# Altium schematic sheet 1_P1.schdoc
size 604 x 431 mm; Symbol: Sheet-Symbol_A2; Device: Sheet-Symbol_A2; @Page Name: P1; @Create Date: 2023-08-03; @Page Count: 1; @Page No: 1; @Project Name: FOC1.0; @Schematic Name: Schematic1; @Update Date: 2023-08-06; Company: 嘉立创EDA; Page Size: A2; Version: V1.0
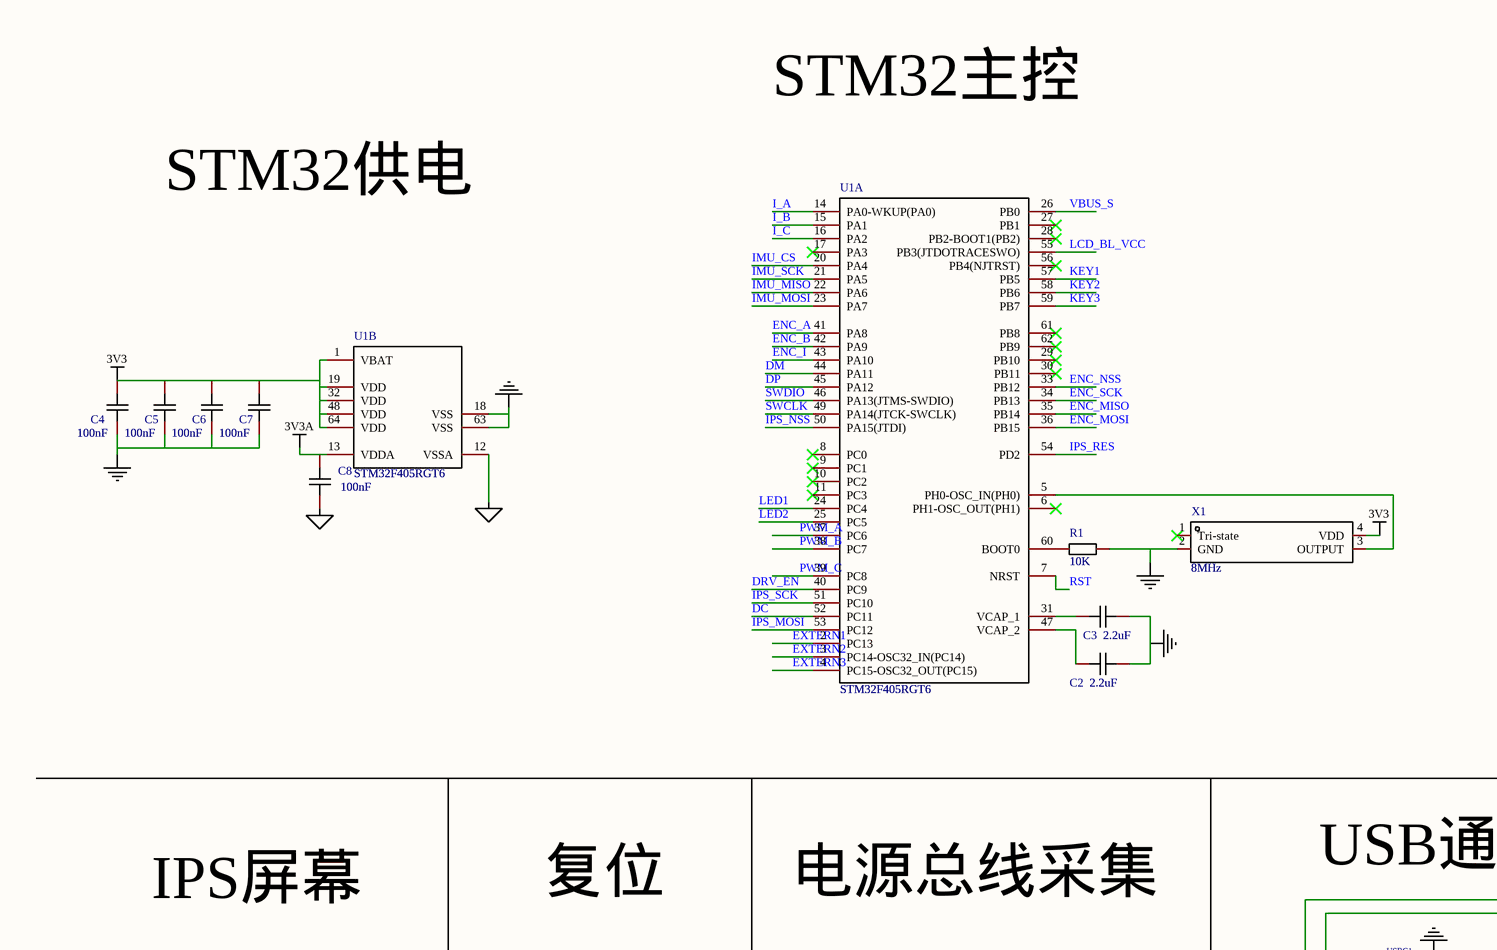
[diagram p0: 1_P1.schdoc, top left]
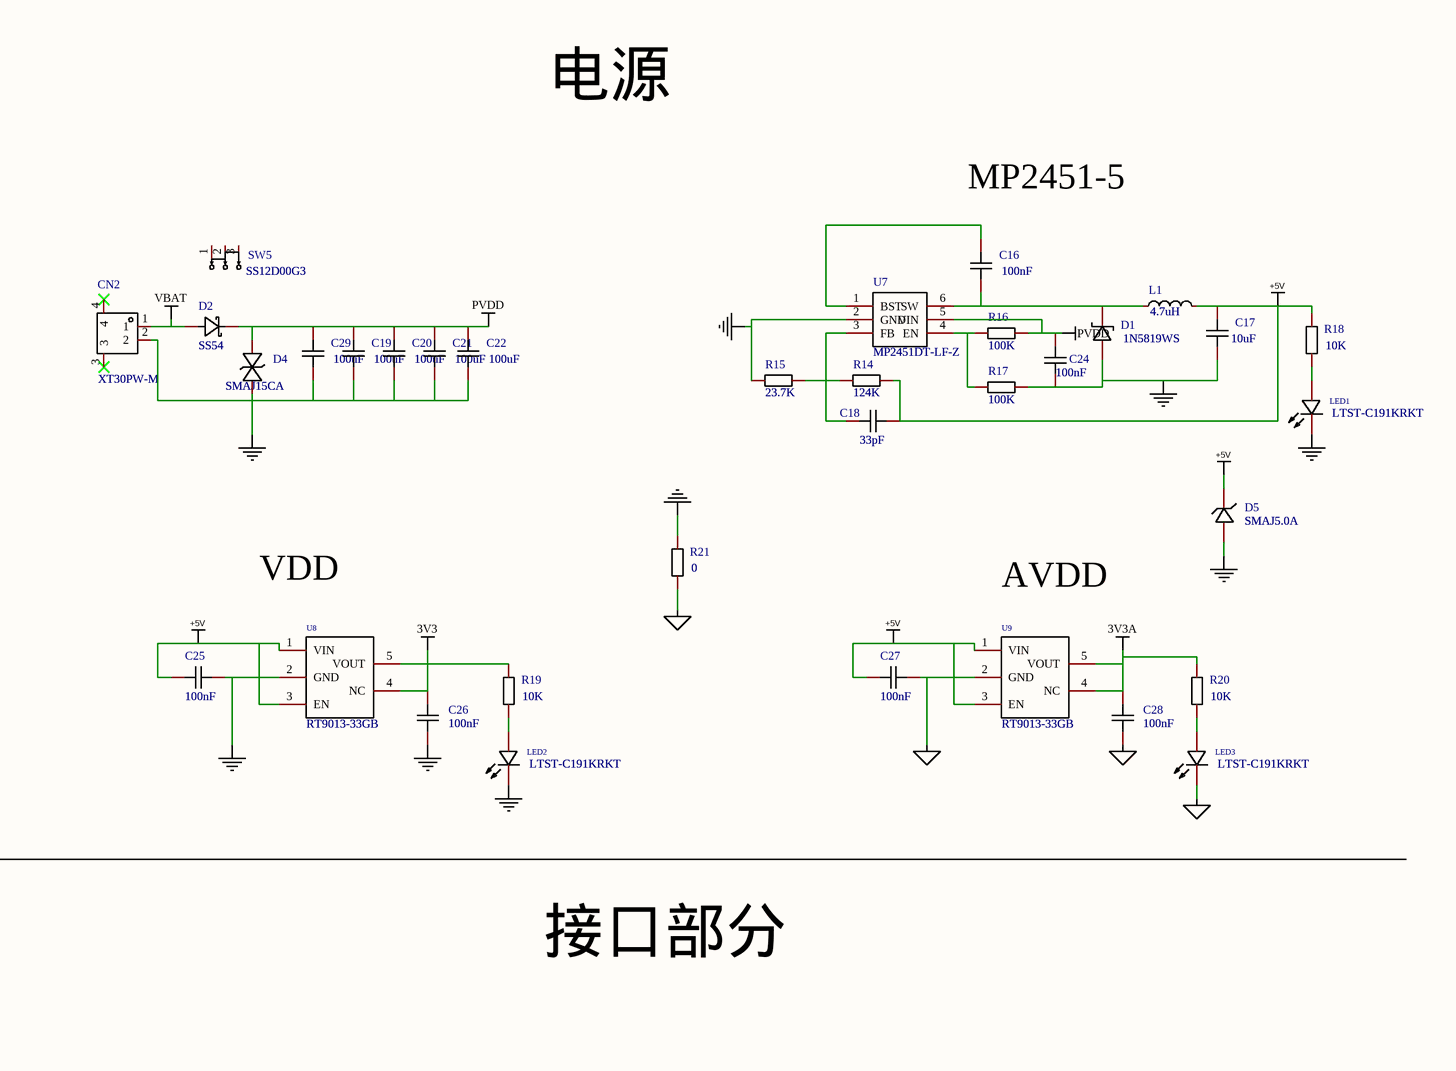
[diagram p1: 1_P1.schdoc, top right]
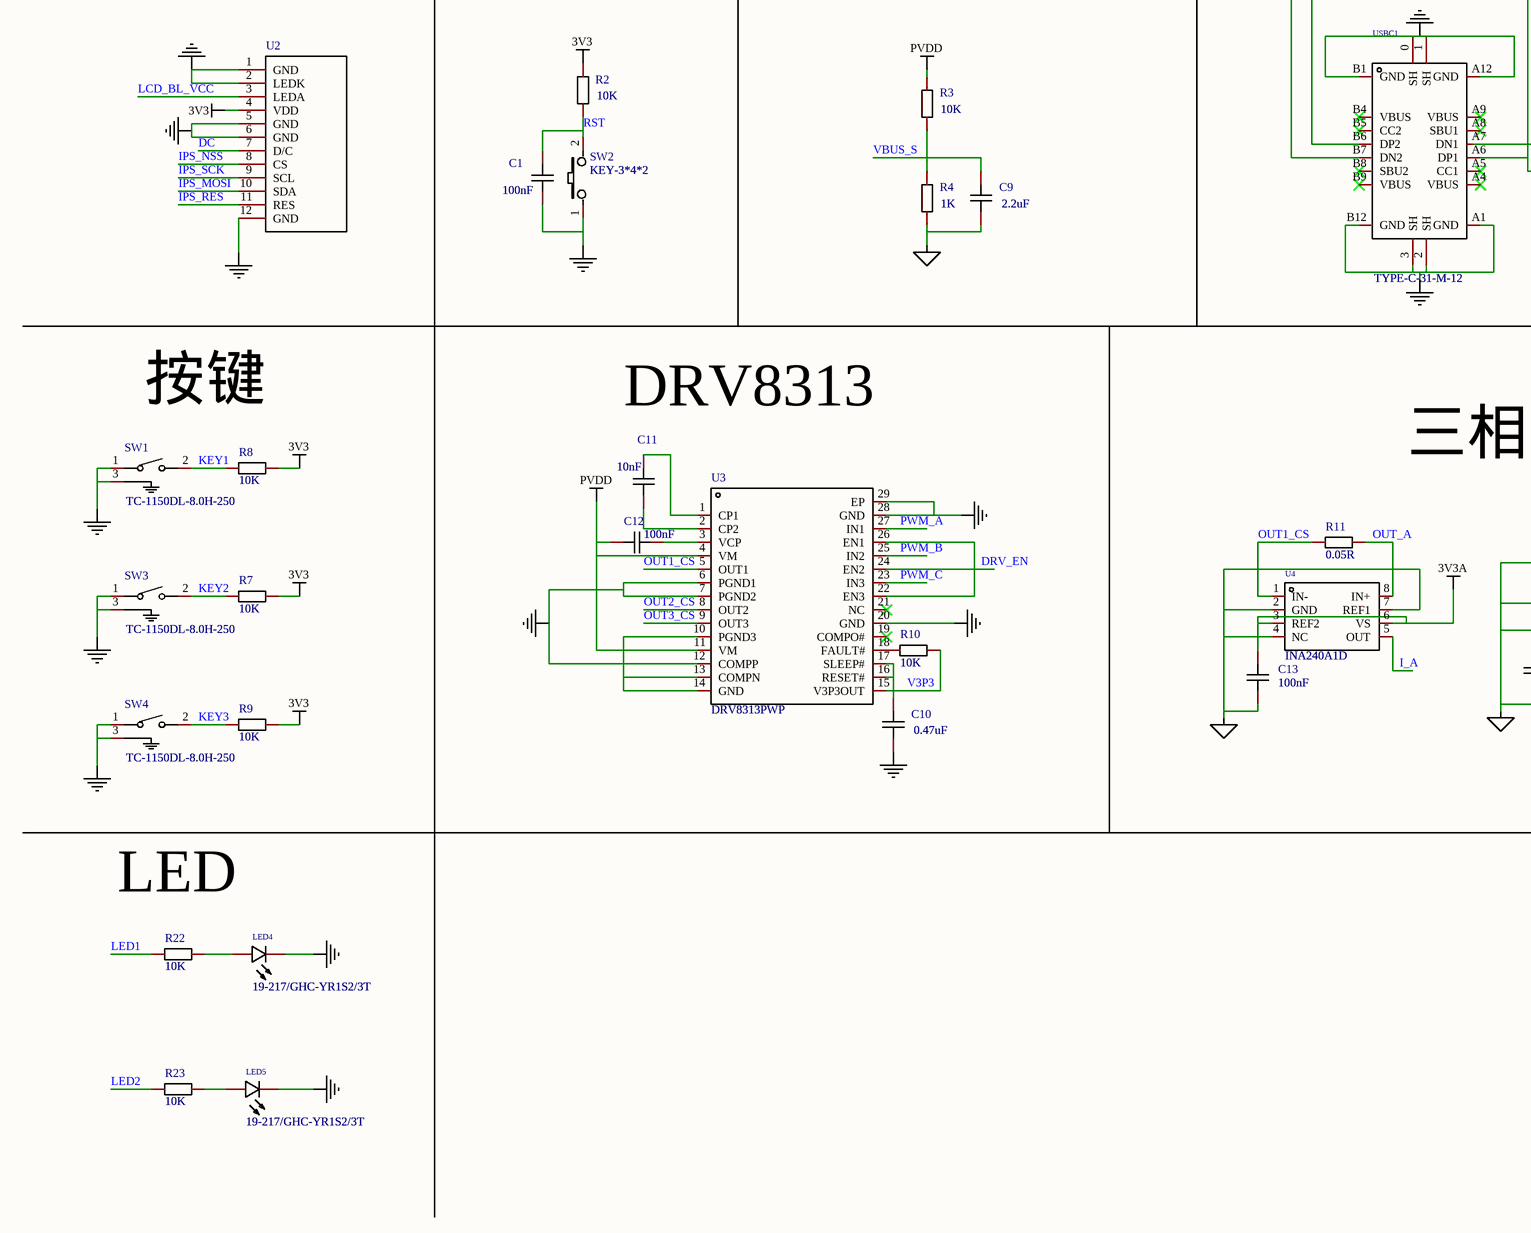
[diagram p2: 1_P1.schdoc, bottom left]
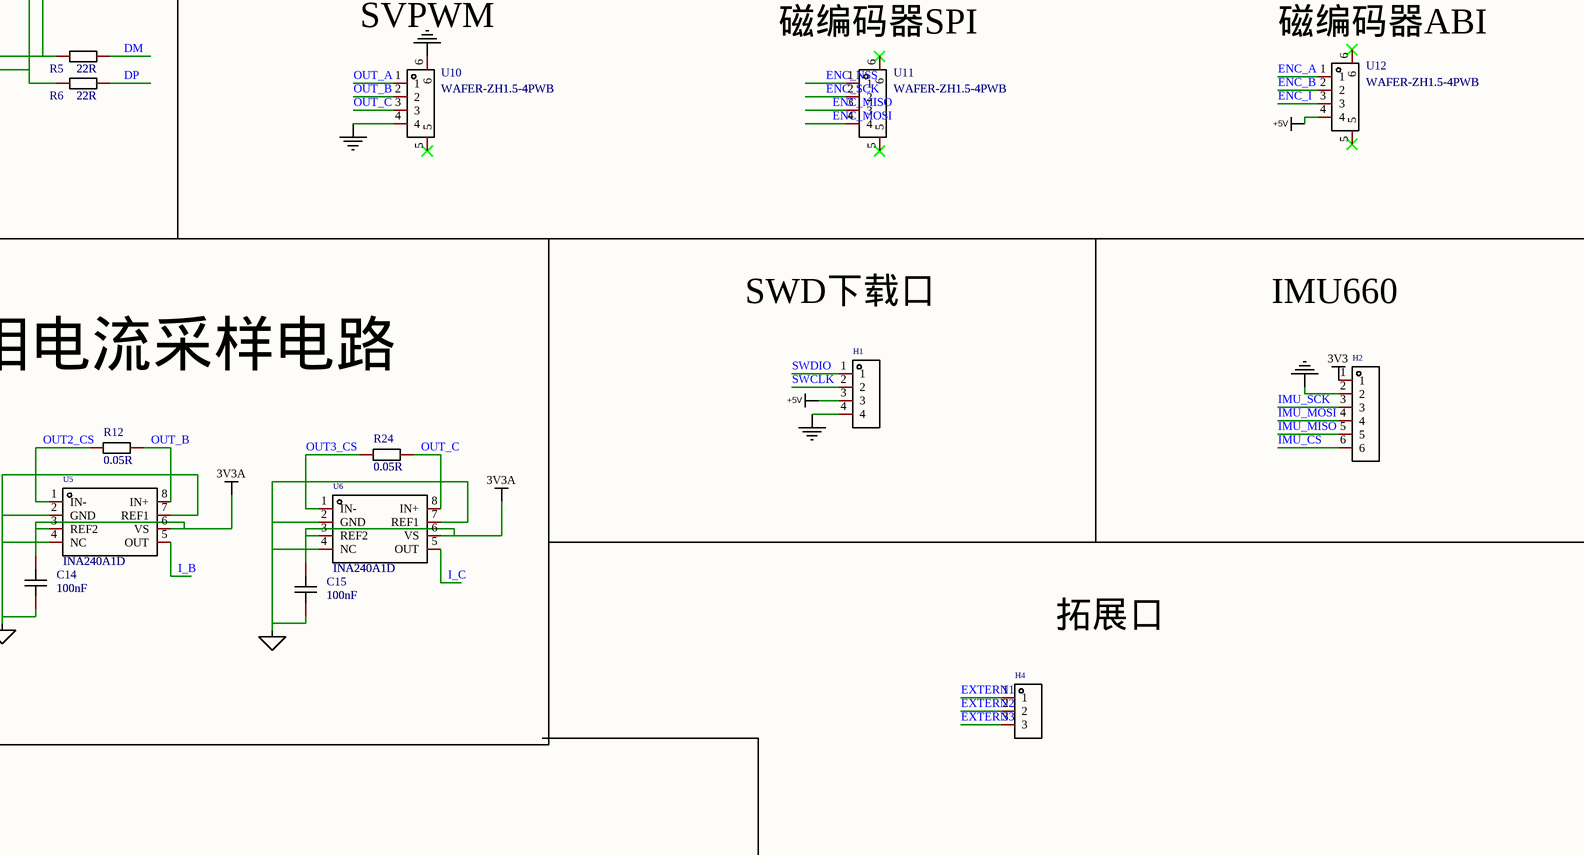
[diagram p3: 1_P1.schdoc, bottom right]

## Parts
C1  100nF  [C0603]
C2  2.2uF  [C0603]
C3  2.2uF  [C0603]
C4  100nF  [C0603]
C5  100nF  [C0603]
C6  100nF  [C0603]
C7  100nF  [C0603]
C8  100nF  [C0603]
C9  2.2uF  [C0603]
C10  0.47uF  [C0603]
C11  10nF  [C0603]
C12  100nF  [C0603]
C13  100nF  [C0603]
C14  100nF  [C0603]
C15  100nF  [C0603]
C16  100nF  [C0603]
C17  10uF  [C0603]
C18  33pF  [C0603]
C19  100uF  [C0805]
C20  100uF  [C0805]
C21  100uF  [C0805]
C22  100uF  [C0805]
C24  100nF  [C0603]
C25  100nF  [C0603]
C26  100nF  [C0603]
C27  100nF  [C0603]
C28  100nF  [C0603]
C29  100uF  [C0805]
CN2  XT30PW-M  [CONN-TH_XT30PW-M]
D1  1N5819WS  [SOD-323_L1.8-W1.3-LS2.5-RD]
D2  SS54  [SMA_L4.3-W2.6-LS5.0-RD]
D4  SMAJ15CA  [SMA_L4.3-W2.5-LS5.0-BI]
D5  SMAJ5.0A  [SMA_L4.4-W2.6-LS5.0-RD]
H1  HDR-F_2.54_1x4P  [HDR-TH_4P-P2.54-V-F]  (value not drawn)
H2  HDR-F_2.54_1x6P  [HDR-TH_6P-P2.54-V-F]  (value not drawn)
H4  HDR-F_2.54_1x3P  [HDR-TH_3P-P2.54-V-F]  (value not drawn)
L1  4.7uH  [IND-SMD_L5.2-W4.7_GPSR0520]
LED1  LTST-C191KRKT  [LED0603-RD]
LED2  LTST-C191KRKT  [LED0603-RD]
LED3  LTST-C191KRKT  [LED0603-RD]
LED4  19-217/GHC-YR1S2/3T  [LED0603-RD]
LED5  19-217/GHC-YR1S2/3T  [LED0603-RD]
R1  10K  [R0603]
R2  10K  [R0603]
R3  10K  [R0603]
R4  1K  [R0603]
R5  22R  [R0603]
R6  22R  [R0603]
R7  10K  [R0603]
R8  10K  [R0603]
R9  10K  [R0603]
R10  10K  [R0603]
R11  0.05R  [R0805]
R12  0.05R  [R0805]
R14  124K  [R0603]
R15  23.7K  [R0603]
R16  100K  [R0603]
R17  100K  [R0603]
R18  10K  [R0603]
R19  10K  [R0603]
R20  10K  [R0603]
R21  0  [R0603]
R22  10K  [R0603]
R23  10K  [R0603]
R24  0.05R  [R0805]
SW1  TC-1150DL-8.0H-250  [SW-SMD_DEALON_TC-1150DL-8.0H-160]
SW2  KEY-3*4*2  [SW-SMD_L4.0-W2.9-LS5.0]
SW3  TC-1150DL-8.0H-250  [SW-SMD_DEALON_TC-1150DL-8.0H-160]
SW4  TC-1150DL-8.0H-250  [SW-SMD_DEALON_TC-1150DL-8.0H-160]
SW5  SS12D00G3  [SW-TH_SS-12D01-GX]
U1  STM32F405RGT6  [LQFP-64_L10.0-W10.0-P0.50-LS12.0-BL]  (parts A,B of 2)
U2  IPS-12P  [IPS]  (value not drawn)
U3  DRV8313PWP  [TSSOP-28_L9.7-W4.4-P0.65-LS6.4-TL-EP-2]
U4  INA240A1D  [SOIC-8_L4.9-W3.9-P1.27-LS6.0-BL]
U5  INA240A1D  [SOIC-8_L4.9-W3.9-P1.27-LS6.0-BL]
U6  INA240A1D  [SOIC-8_L4.9-W3.9-P1.27-LS6.0-BL]
U7  MP2451DT-LF-Z  [SOT-23-6_L2.9-W1.6-P0.95-LS2.8-BR]
U8  RT9013-33GB  [SOT-23-5_L3.0-W1.7-P0.95-LS2.8-BL]
U9  RT9013-33GB  [SOT-23-5_L3.0-W1.7-P0.95-LS2.8-BL]
U10  WAFER-ZH1.5-4PWB  [CONN-SMD_4P-P1.50_XUNPU_WAFER-ZH1.5-4PWB]
U11  WAFER-ZH1.5-4PWB  [CONN-SMD_4P-P1.50_XUNPU_WAFER-ZH1.5-4PWB]
U12  WAFER-ZH1.5-4PWB  [CONN-SMD_4P-P1.50_XUNPU_WAFER-ZH1.5-4PWB]
USBC1  TYPE-C-31-M-12  [USB-C_SMD-TYPE-C-31-M-12]
X1  8MHz  [OSC-SMD_4P-L3.2-W2.5-BL]

## Nets
3V3: C4.2 C5.2 C6.2 C7.2 C26.2 H2.1 R2.2 R7.2 R8.2 R9.2 R19.2 U1.1(VBAT) U1.19(VDD) U1.32(VDD) U1.48(VDD) U1.64(VDD) U2.4(VDD) U8.4(NC) U8.5(VOUT) X1.4(VDD)
3V3A: C8.2 C13.2 C14.2 C15.2 C28.2 R20.2 U1.13(VDDA) U4.3(REF2) U4.6(VS) U5.3(REF2) U5.6(VS) U6.3(REF2) U6.6(VS) U9.4(NC) U9.5(VOUT)
+5V: C17.2 C18.2 C25.1 C27.1 D5.1 H1.3 L1.2 R14.2 R18.2 U8.1(VIN) U8.3(EN) U9.1(VIN) U9.3(EN) U12.4
NetC1_1: C1.1 C2.2 C3.2 C4.1 C5.1 C6.1 C7.1 C8.1 C9.1 C10.1 C13.1 C14.1 C15.1 C17.1 C19.1 C20.1 C21.1 C22.1 C24.1 C25.2 C26.1 C27.2 C28.1 C29.1 CN2.2 D1.2(A) D4.1 D5.2 H1.4 H2.2 LED1.1(-) LED2.1(-) LED3.1(-) LED4.1(C) LED5.1(C) R1.2 R4.1 R15.1 R17.2 R21.1 R21.2 SW1.1 SW1.3 SW2.1 SW3.1 SW3.3 SW4.1 SW4.3 U1.12(VSSA) U1.18(VSS) U1.63(VSS) U2.1(GND) U2.2(LEDK) U2.5(GND) U2.6(GND) U2.12(GND) U3.6(PGND1) U3.7(PGND2) U3.10(PGND3) U3.12(COMPP) U3.13(COMPN) U3.14(GND) U3.20(GND) U3.28(GND) U3.29(EP) U4.2(GND) U4.4(NC) U4.7(REF1) U5.2(GND) U5.4(NC) U5.7(REF1) U6.2(GND) U6.4(NC) U6.7(REF1) U7.2(GND) U8.2(GND) U9.2(GND) U10.4 U10.6 USBC1.0(SH) USBC1.1(SH) USBC1.2(SH) USBC1.3(SH) USBC1.A1(GND) USBC1.A12(GND) USBC1.B1(GND) USBC1.B12(GND) X1.2(GND)
PVDD: C12.1 C19.2 C20.2 C21.2 C22.2 C24.2 C29.2 D2.1 D4.2 R3.2 R16.2 U3.4(VM) U3.11(VM) U7.5(VIN)
VBAT: CN2.1 D2.2
DC: U1.52(PC11) U2.7(D/C)
DM: R5.2 U1.44(PA11)
DP: R6.2 U1.45(PA12)
DRV_EN: U1.40(PC9) U3.22(EN3) U3.24(EN2) U3.26(EN1)
ENC_A: U1.41(PA8) U12.1
ENC_B: U1.42(PA9) U12.2
ENC_I: U1.43(PA10) U12.3
ENC_MISO: U1.35(PB14) U11.3
ENC_MOSI: U1.36(PB15) U11.4
ENC_NSS: U1.33(PB12) U11.1
ENC_SCK: U1.34(PB13) U11.2
EXTERN1: H4.1 U1.2(PC13)
EXTERN2: H4.2 U1.3(PC14-OSC32_IN(PC14))
EXTERN3: H4.3 U1.4(PC15-OSC32_OUT(PC15))
I_A: U1.14(PA0-WKUP(PA0)) U4.5(OUT)
I_B: U1.15(PA1) U5.5(OUT)
I_C: U1.16(PA2) U6.5(OUT)
IMU_CS: H2.6 U1.20(PA4)
IMU_MISO: H2.5 U1.22(PA6)
IMU_MOSI: H2.4 U1.23(PA7)
IMU_SCK: H2.3 U1.21(PA5)
IPS_MOSI: U1.53(PC12) U2.10(SDA)
IPS_NSS: U1.50(PA15(JTDI)) U2.8(CS)
IPS_RES: U1.54(PD2) U2.11(RES)
IPS_SCK: U1.51(PC10) U2.9(SCL)
KEY1: R8.1 SW1.2 U1.57(PB5)
KEY2: R7.1 SW3.2 U1.58(PB6)
KEY3: R9.1 SW4.2 U1.59(PB7)
LCD_BL_VCC: U1.55(PB3(JTDOTRACESWO)) U2.3(LEDA)
LED1: R22.1 U1.24(PC4)
LED2: R23.1 U1.25(PC5)
OUT1_CS: R11.1 U3.5(OUT1) U4.1(IN-)
OUT2_CS: R12.1 U3.8(OUT2) U5.1(IN-)
OUT3_CS: R24.1 U3.9(OUT3) U6.1(IN-)
OUT_A: R11.2 U4.8(IN+) U10.1
OUT_B: R12.2 U5.8(IN+) U10.2
OUT_C: R24.2 U6.8(IN+) U10.3
PWM_A: U1.37(PC6) U3.27(IN1)
PWM_B: U1.38(PC7) U3.25(IN2)
PWM_C: U1.39(PC8) U3.23(IN3)
RST: C1.2 R2.1 SW2.2 U1.7(NRST)
SWCLK: H1.2 U1.49(PA14(JTCK-SWCLK))
SWDIO: H1.1 U1.46(PA13(JTMS-SWDIO))
V3P3: C10.2 R10.2 U3.15(V3P3OUT) U3.16(RESET#) U3.17(SLEEP#)
VBUS_S: C9.2 R3.1 R4.2 U1.26(PB0)
NetC2_1: C2.1 U1.47(VCAP_2)
NetC3_1: C3.1 U1.31(VCAP_1)
NetC11_1: C11.1 U3.2(CP2)
NetC11_2: C11.2 U3.1(CP1)
NetC12_2: C12.2 U3.3(VCP)
NetC16_1: C16.1 D1.1(C) L1.1 U7.6(SW)
NetC16_2: C16.2 U7.1(BST)
NetC18_1: C18.1 R14.1 R15.2 U7.3(FB)
NetLED1_2: LED1.2(+) R18.1
NetLED2_2: LED2.2(+) R19.1
NetLED3_2: LED3.2(+) R20.1
NetLED4_2: LED4.2(A) R22.2
NetLED5_2: LED5.2(A) R23.2
NetR1_1: R1.1 U1.60(BOOT0)
NetR5_1: R5.1 USBC1.A7(DN1) USBC1.B7(DN2)
NetR6_1: R6.1 USBC1.A6(DP1) USBC1.B6(DP2)
NetR10_1: R10.1 U3.18(FAULT#)
NetR16_1: R16.1 R17.1 U7.4(EN)
NetU1_5: U1.5(PH0-OSC_IN(PH0)) X1.3(OUTPUT)

Not connected (* = marked no-connect by the designer): CN2 3* 4*; SW5 1 2 3; U1 6(PH1-OSC_OUT(PH1))* 8(PC0)* 9(PC1)* 10(PC2)* 11(PC3)* 17(PA3)* 27(PB1)* 28(PB2-BOOT1(PB2))* 29(PB10)* 30(PB11)* 56(PB4(NJTRST))* 61(PB8)* 62(PB9)*; U3 19(COMPO#)* 21(NC)*; U10 5*; U11 5* 6*; U12 5* 6*; USBC1 A4(VBUS)* A5(CC1)* A8(SBU1)* A9(VBUS)* B4(VBUS)* B5(CC2)* B8(SBU2)* B9(VBUS)*; X1 1(Tri-state)*

## Notes on the sheet
- 电源
- STM32主控
- MP2451-5
- STM32供电
- VDD
- AVDD
- IPS屏幕
- 复位
- 电源总线采集
- USB通讯
- 接口部分
- (near U10) SVPWM
- (near U11) 磁编码器SPI
- (near U12) 磁编码器ABI
- 按键
- (near C11) DRV8313
- SWD下载口
- IMU660
- 三相电流采样电路
- 拓展口
- LED
- 1
- 2
- 3
- 4
- 5
- 6
- A
- B
- C
- D
- 原理图
- Schematic1
- 创建日期
- 更新日期
- 2023-08-03
- 2023-08-06
- 审阅
- 绘制
- 图页
- P1
- 物料编码
- FOC1.0
- 版本
- 尺寸
- 页
- 共
- V1.0
- A2
- 嘉立创EDA

## Library data of the parts
C1-C18 C24-C28 = CAP_0603: Symbol: CapAcitance; Convert to PCB: yes; Device: CAP_0603; Add into BOM: yes; Supplier Footprint: 0603
  C1 C4-C8 C12-C16 C24-C28: Name: 100nF; Value: 100nF
  C2 C3 C9: Name: 2.2uF; Value: 2.2uF
  C10: Name: 0.47uF; Value: 0.47uF
  C11: Name: 10nF; Value: 10nF
  C17: Name: 10uF; Value: 10uF
  C18: Name: 33pF; Value: 33pF
C19-C22 C29 = CAP_0805: Symbol: CapAcitance; Convert to PCB: yes; Name: 100uF; Device: CAP_0805; Add into BOM: yes; Supplier Footprint: 0805; Value: 100uF
CN2 = XT30PW-M: Socket,DCsupply,XT30,male,PIN:2; Manufacturer: AMASS(艾迈斯); Add into BOM: yes; Name: XT30PW-M; Symbol: XT30PW-M; Device: XT30PW-M; LCSC Part Name: AMASS(艾迈斯)航模插头 卧式弯脚 XT30PW-M公头; Supplier Part: C431092; Manufacturer Part: XT30PW-M; Supplier Footprint: -; JLCPCB Part Class: 扩展库; Datasheet: https://atta.szlcsc.com/upload/public/pdf/source/20220222/6A9F22F7850E25B33E1BE430ADF8560B.pdf; Supplier: LCSC; Convert to PCB: yes
D1 = 1N5819WS_C191023: 直流反向耐压(Vr):40V;平均整流电流(Io):1A;正向压降(Vf):600mV@1A;; Manufacturer: Hottech(合科泰); Add into BOM: yes; Reverse Voltage (Vr): 40V; Average Rectified Current (Io): 1A; Name: 1N5819WS; Symbol: 1N5819WS; Device: 1N5819WS_C191023; LCSC Part Name: 40V 1A 600mV@1A; Supplier Part: C191023; Manufacturer Part: 1N5819WS; Supplier Footprint: SOD-323; JLCPCB Part Class: 基础库; Datasheet: https://atta.szlcsc.com/upload/public/pdf/source/20220428/3CB86FD8D28D653594B4E35F9D5AEFD9.pdf; Supplier: LCSC; Convert to PCB: yes; Forward Voltage (Vf@If): 600mV@1A
D2 = SS54_C727065: 二极管配置:独立式;直流反向耐压(Vr):40V;平均整流电流(Io):5A;正向压降(Vf):550mV@5A;反向电流(Ir):500uA@40V;; Manufacturer: TWGMC(台湾迪嘉); Add into BOM: yes; Diode Configuration: 独立式; Reverse Voltage (Vr): 40V; Average Rectified Current (Io): 5A; Name: SS54; Symbol: SS54_C727065; Device: SS54_C727065; LCSC Part Name: 40V 5A 550mV@5A; Supplier Part: C727065; Manufacturer Part: SS54; Supplier Footprint: SMA; JLCPCB Part Class: 扩展库; Datasheet: https://atta.szlcsc.com/upload/public/pdf/source/20200828/C727064_BD0A2B36CBC76CEA4B6710C57718D41F.pdf; Supplier: LCSC; Convert to PCB: yes; Forward Voltage (Vf@If): 550mV@5A; Reverse Leakage Current (Ir): 500uA@40V
D4 = SMAJ15CA_C726784: 极性:双向;; Manufacturer: TWGMC(台湾迪嘉); Add into BOM: yes; Polarity: 双向; Name: SMAJ15CA; Symbol: SMAJ15CA_C726784; Device: SMAJ15CA_C726784; LCSC Part Name: 双向; Supplier Part: C726784; Manufacturer Part: SMAJ15CA; Supplier Footprint: SMA; JLCPCB Part Class: 扩展库; Datasheet: https://atta.szlcsc.com/upload/public/pdf/source/20200827/C726731_3930C18E0BE7F90724BF034A8102E5CA.pdf; Supplier: LCSC; Convert to PCB: yes
D5 = SMAJ5.0A_C113952: 极性:单向;反向截止电压(Vrwm):5V;击穿电压:6.4V;反向漏电流(Ir):800uA;峰值脉冲电流(Ipp)@10/1000s:43.5A;最大钳位电压:9.2V;; Manufacturer: MDD; Add into BOM: yes; Polarity: 单向; Reverse Stand-Off Voltage (Vrwm): 5V; Breakdown Voltage: 6.4V; Reverse Leakage Current (Ir): 800uA; Peak Pulse Current (Ipp)@10/1000μs: 43.5A; Maximum Clamping Voltage: 9.2V; Name: SMAJ5.0A; Symbol: SMAJ5.0A_C113952; Device: SMAJ5.0A_C113952; LCSC Part Name: 单向 Vrwm:5V; Supplier Part: C113952; Manufacturer Part: SMAJ5.0A; Supplier Footprint: SMA(DO-214AC); JLCPCB Part Class: 扩展库; Datasheet: https://atta.szlcsc.com/upload/public/pdf/source/20230314/4319D8044EE29783A53F6AC60595AA71.pdf; Supplier: LCSC; Convert to PCB: yes
H1 = HDR-F_2.54_1x4P: Manufacturer: BOOMELE(博穆精密); Symbol: 2.54-1*4P母; Convert to PCB: yes; Device: HDR-F_2.54_1x4P; Add into BOM: yes; Supplier Part: C2718488; Supplier Footprint: 插件; Supplier: LCSC; Manufacturer Part: 2.54-1*4P母; JLCPCB Part Class: Extended Part
H2 = HDR-F_2.54_1x6P: Manufacturer: BOOMELE(博穆精密); Manufacturer Part: 2.54-1*6P母; Symbol: Header-Female-2.54_1x6; Convert to PCB: yes; Device: HDR-F_2.54_1x6P; Add into BOM: yes; Supplier Part: C40877; Supplier Footprint: 插件; Supplier: LCSC; JLCPCB Part Class: Extended Part
H4 = HDR-F_2.54_1x3P: Manufacturer: XFCN(兴飞); Symbol: PM254V-11-03-H85; Convert to PCB: yes; Device: HDR-F_2.54_1x3P; Add into BOM: yes; Supplier Part: C541850; Supplier Footprint: 插件; Supplier: LCSC; Manufacturer Part: PM254V-11-03-H85; JLCPCB Part Class: Extended Part
L1 = GPSR0520-4R7M: 电感值:4.7uH;精度:±20%;额定电流:3.2A;; Manufacturer: Gantong(感通); Add into BOM: yes; Tolerance: ±20%; Rated Current: 3.2A; DC Resistance (DCR): 68mΩ; Name: 4.7uH; Symbol: GPSR0520-4R7M; Device: GPSR0520-4R7M; LCSC Part Name: 4.7uH ±20% 3.2A 68mΩ AEC-Q200 车规级一体成型模压电感 SGTE; Supplier Part: C477157; Manufacturer Part: GPSR0520-4R7M; Supplier Footprint: SMD; JLCPCB Part Class: 扩展库; Datasheet: https://atta.szlcsc.com/upload/public/pdf/source/20200331/C477151_65EF27273CBC45D39FA7B5495F8A6275.pdf; Supplier: LCSC; Convert to PCB: yes; Value: 4.7uH
LED1-LED3 = LTST-C191KRKT: 发光颜色:红灯;二极管配置:-;透镜颜色:无色透明;主波长:631nm;色温:-;功率:75mW;发光角度:130°;安装方式:-;工作温度:-55℃~+85℃;; Manufacturer: LITEON(光宝); Add into BOM: yes; Emitted Color: 红灯; Lens Color: 无色透明; Dominant Wavelength: 631nm; Peak Wavelength: 639nm; Forward Current: 20mA; Forward Voltage (VF): 2V; Power Dissipation: 75mW; Viewing Angle: 130°; Name: LTST-C191KRKT; Symbol: LTST-C191KRKT; Device: LTST-C191KRKT; LCSC Part Name: 红灯; Supplier Part: C125099; Manufacturer Part: LTST-C191KRKT; Supplier Footprint: 0603; JLCPCB Part Class: 扩展库; Datasheet: https://atta.szlcsc.com/upload/public/pdf/source/20180129/C125099_15171878294931315872.pdf; Supplier: LCSC; Convert to PCB: yes; Diode Configuration: -; Color Temperature: -; Mounting Sytle: -; Operating Temperature: -55℃~+85℃
LED4 = 19-217/GHC-YR1S2/3T: 发光颜色:翠绿;二极管配置:-;主波长:520nm~535nm;色温:-;功率:110mW;安装方式:-;; Manufacturer: EVERLIGHT(亿光); Add into BOM: yes; Emitted Color: 翠绿; Lens Color: 无色透明; Peak Wavelength: 518nm; Forward Current: 20mA; Power Dissipation: 110mW; Viewing Angle: 120°; Name: 19-217/GHC-YR1S2/3T; Symbol: 19-217/GHC-YR1S2/3T; Device: 19-217/GHC-YR1S2/3T; LCSC Part Name: 翠绿; Supplier Part: C72043; Manufacturer Part: 19-217/GHC-YR1S2/3T; Supplier Footprint: 0603; JLCPCB Part Class: 基础库; Datasheet: https://atta.szlcsc.com/upload/public/pdf/source/20160507/1462613613780.pdf; Supplier: LCSC; Convert to PCB: yes; Diode Configuration: -; Dominant Wavelength: 520nm~535nm; Color Temperature: -; Mounting Sytle: -; Operating Temperature: -40℃~+85℃
LED5 = 19-217/GHC-YR1S2/3T: 发光颜色:翠绿;二极管配置:-;主波长:520nm~535nm;色温:-;功率:110mW;安装方式:-;; Manufacturer: EVERLIGHT(亿光); Add into BOM: yes; Emitted Color: 翠绿; Lens Color: 无色透明; Peak Wavelength: 518nm; Forward Current: 20mA; Power Dissipation: 110mW; Viewing Angle: 120°; NUMBER: 1; Name: 19-217/GHC-YR1S2/3T; Symbol: 19-217/GHC-YR1S2/3T; Device: 19-217/GHC-YR1S2/3T; LCSC Part Name: 翠绿; Supplier Part: C72043; Manufacturer Part: 19-217/GHC-YR1S2/3T; Supplier Footprint: 0603; JLCPCB Part Class: 基础库; Datasheet: https://atta.szlcsc.com/upload/public/pdf/source/20160507/1462613613780.pdf; Supplier: LCSC; Convert to PCB: yes; Diode Configuration: -; Dominant Wavelength: 520nm~535nm; Color Temperature: -; Mounting Sytle: -; Operating Temperature: -40℃~+85℃
R1-R10 R14-R23 = Res_0603: Symbol: 电阻; Convert to PCB: yes; Device: Res_0603; Add into BOM: yes; Supplier Footprint: 0603
  R1-R3 R7-R10 R18-R20 R22 R23: Name: 10K; Value: 10K
  R4: Name: 1K; Value: 1K
  R5 R6: Name: 22R; Value: 22R
  R14: Name: 124K; Value: 124K
  R15: Name: 23.7K; Value: 23.7K
  R16 R17: Name: 100K; Value: 100K
  R21: Name: 0; Value: 0
R11 R12 R24 = Res_0805: Symbol: 电阻; Convert to PCB: yes; Name: 0.05R; Device: Res_0805; Add into BOM: yes; Supplier Footprint: 0805; Value: 0.05R
SW1 SW3 SW4 = TC-1150DL-8.0H-250: 电路结构:单刀单掷;安装方式:卧插;作用力:250gf@±50gf;机械寿命:-;带支架:否;; Manufacturer: DEALON(德艺隆); Add into BOM: yes; Circuit: 单刀单掷; Actuator Style: 圆形按钮; Actuator/Cap Color: 黑色; Pin Style: PC引脚; Switch Length: 4.5mm; Switch Height: 8mm; Strike Gundam: 否; Name: TC-1150DL-8.0H-250; Symbol: TC-1150DL-8.0H-250; Device: TC-1150DL-8.0H-250; LCSC Part Name: 4.5*4.5*8mm 卧插 轻触开关 侧按; Supplier Part: C2905086; Manufacturer Part: TC-1150DL-8.0H-250; Supplier Footprint: 插件; JLCPCB Part Class: 扩展库; Datasheet: https://atta.szlcsc.com/upload/public/pdf/source/20211209/7133B8AC02BC3D68D7AB6F8102121C13.pdf; Supplier: LCSC; Convert to PCB: yes; Mounting Style: 卧插; Operating Force: 250gf@±50gf; Mechanical Life: -; Switch Width: 4.5mm
SW2 = KEY-3*4*2: Add into BOM: yes; Name: KEY-3*4*2; Symbol: KEY-3*4*2; Device: KEY-3*4*2; LCSC Part Name: KEY-3*4*2; Supplier Part: C9900015662; Manufacturer Part: KEY-3*4*2; Supplier Footprint: KEY; JLCPCB Part Class: 扩展库; Datasheet: https://atta.szlcsc.comnull; Supplier: LCSC; Convert to PCB: yes
SW5 = SS12D00G3: Add into BOM: yes; Name: SS12D00G3; Symbol: SS12D00G3; Device: SS12D00G3; LCSC Part Name: SS12D00G3; Supplier Part: C9900018735; Manufacturer Part: SS12D00G3; Supplier Footprint: SW-TH; JLCPCB Part Class: 扩展库; Supplier: LCSC; Convert to PCB: yes
U1 = STM32F405RGT6: CPU内核:ARM Cortex-M4;CPU最大主频:168MHz;程序存储容量:1MB;程序存储器类型:FLASH;RAM总容量:192KB;GPIO端口数量:51;; Manufacturer: ST(意法半导体); Add into BOM: yes; CPU Maximum Speed: 168MHz; Operating Voltage Range: 1.8V~3.6V; Program Storage Size: 1MB; Program Memory Type: FLASH; RAM Size: 192KB; GPIO Ports Number: 51; ADC (Bit): 12bit; Universal Serial Bus: 有; Peripheral/Function: DMA；LCD/LED驱动；PWM; Name: STM32F405RGT6; Symbol: STM32F405RGT6; Device: STM32F405RGT6; LCSC Part Name: ARM Cortex-M4 168MHz; Supplier Part: C15742; Manufacturer Part: STM32F405RGT6; Supplier Footprint: LQFP-64(10x10); JLCPCB Part Class: 扩展库; Datasheet: https://atta.szlcsc.com/upload/public/pdf/source/20140724/1457707160365.pdf; Supplier: LCSC; Convert to PCB: yes; CPU Core: ARM Cortex-M4; EEPROM: -; DAC (Bit): 12bit; PWM (Bit): -; Internal Comparator: -; communication protocol: -; Watchdog: 有; Real-Time Clock: -; Infrared Data Association: 有; Low-Voltage Detect: 有; CCP Capture/Compare: -; LCD Module: 有; Secure Digital Input and Output: -; Direct Memory Access: 有; Internal Oscillator: 有; Operating Temperature Range: -40℃~+85℃
U2 = IPS-12P: Add into BOM: yes; Symbol: IPS-12P; Device: IPS-12P; Convert to PCB: yes
U3 = DRV8313PWP: 最大电压为 65V 的 3A 峰值三相电机驱动器 28-HTSSOP -40 to 125; Manufacturer: TI(德州仪器); Add into BOM: yes; Name: DRV8313PWP; Symbol: DRV8313PWP; Device: DRV8313PWP; LCSC Part Name: DRV8313PWP; Supplier Part: C2863441; Manufacturer Part: DRV8313PWP; Supplier Footprint: HTSSOP-28-EP-4.5mm; JLCPCB Part Class: 扩展库; Supplier: LCSC; Convert to PCB: yes
U4-U6 = INA240A1D: 通道数:1;; Manufacturer: TI(德州仪器); Add into BOM: yes; Number of Channels: 1; Supply Current: 1.8mA; Name: INA240A1D; Symbol: INA240A1D; Device: INA240A1D; LCSC Part Name: INA240A1D; Supplier Part: C1346458; Manufacturer Part: INA240A1D; Supplier Footprint: SOIC-8; Datasheet: https://www.ti.com/cn/lit/gpn/ina2180; Supplier: LCSC; Convert to PCB: yes; Operating Temperature: -40℃~+125℃
U7 = MP2451DT-LF-Z: 最大输入电压:-;可输出电流:-;; Add into BOM: yes; Name: MP2451DT-LF-Z; Symbol: MP2451DT-LF-Z; Device: MP2451DT-LF-Z; LCSC Part Name: MP2451DT-LF-Z; Supplier Part: C14123; Manufacturer Part: MP2451DT-LF-Z; Supplier Footprint: SOT-23-6; JLCPCB Part Class: 扩展库; Datasheet: https://atta.szlcsc.com/upload/public/pdf/source/20200722/C14123_A1B4D2FF88F8729F8C1A187DEC359FB0.pdf; Supplier: LCSC; Convert to PCB: yes
U8 U9 = RT9013-33GB: 输出类型:固定;输出极性:正;最大输入电压:5.5V;输出电压:3.3V;输出电流:500mA;电源纹波抑制比(PSRR):50dB@(10kHz);; Manufacturer: RICHTEK(立锜); Add into BOM: yes; Output Type: 固定; Output Polarity: 正; Number of Outputs: 1; Maximum Input Voltage: 5.5V; Output Voltage: 3.3V; Dropout Voltage: 400mV@(500mA); Quiescent Current (Ground Current): 50uA; Output Current: 500mA; Name: RT9013-33GB; Symbol: RT9013-33GB; Device: RT9013-33GB; LCSC Part Name: 输入5.5V 输出3.3V 500mA; Supplier Part: C47773; Manufacturer Part: RT9013-33GB; Supplier Footprint: SOT-23-5; JLCPCB Part Class: 扩展库; Datasheet: https://atta.szlcsc.com/upload/public/pdf/source/20150504/1457707282459.pdf; Supplier: LCSC; Convert to PCB: yes; Power Supply Rejection Ratio (PSRR): 50dB@(10kHz); Noise: -; Feature: -; Operating Temperature: -40℃~+85℃
U10-U12 = WAFER-ZH1.5-4PWB: Manufacturer: XUNPU(讯普); Add into BOM: yes; Name: WAFER-ZH1.5-4PWB; Symbol: WAFER-ZH1.5-4PWB; Device: WAFER-ZH1.5-4PWB; LCSC Part Name: ZH1.5mm 4P 卧贴; Supplier Part: C3029424; Manufacturer Part: WAFER-ZH1.5-4PWB; Supplier Footprint: SMD,P=1.5mm; JLCPCB Part Class: Extended Part; Datasheet: https://atta.szlcsc.com/upload/public/pdf/source/20220527/F63BB9927793921BBB0650484B18B1AD.pdf; Supplier: LCSC; Convert to PCB: yes
USBC1 = TYPE-C-31-M-12: 连接器类型:Type-C;标准:-;公母:母座;触点数量:16P;端口数量:1;安装方式:-;额定电流 - 电源:5A;触头材质:-;触头镀层:-;工作温度范围:-;焊接温度(最大值):-;; Manufacturer: 韩国韩荣; Add into BOM: yes; Connector Type: Type-C; Gender: 母座; Number of Contacts: 16P; Number of Ports: 1; Current Rating - Power (Max): 5A; Name: TYPE-C-31-M-12; Symbol: TYPE-C-31-M-12; Device: TYPE-C-31-M-12; LCSC Part Name: Type-C 母座; Supplier Part: C165948; Manufacturer Part: TYPE-C-31-M-12; Supplier Footprint: SMD; JLCPCB Part Class: 扩展库; Datasheet: https://atta.szlcsc.com/upload/public/pdf/source/20220525/466408E853115E789EDB0DDC29077C05.pdf; Supplier: LCSC; Convert to PCB: yes; Standard: -; Mounting Style: -; Contact Material: -; Contact Plating: -; Operating Temperature Range: -; Welding Temperature (Max): -
X1 = OT32258MJBA4SL: 频率:8MHz;频率稳定度:±10ppm;工作电压:1.8V~3.3V;; Manufacturer: YXC(扬兴晶振); Add into BOM: yes; Frequency Stability: ±10ppm; Name: 8MHz; Symbol: OT32258MJBA4SL; Device: OT32258MJBA4SL; LCSC Part Name: 8MHz ±10ppm 1.8V~3.3V YSO110TR; Supplier Part: C717687; Manufacturer Part: OT32258MJBA4SL; Supplier Footprint: SMD3225-4P; JLCPCB Part Class: 扩展库; Datasheet: https://atta.szlcsc.com/upload/public/pdf/source/20210329/C669065_30B18CFE780D377BA4E84F6ED1951959.pdf; Supplier: LCSC; Convert to PCB: yes; Value: 8MHz; Supply Voltage: 1.8V~3.3V; Operating Temperature: -40℃~+85℃